# EAGLE design G009B (EAGLE 6.6.0)
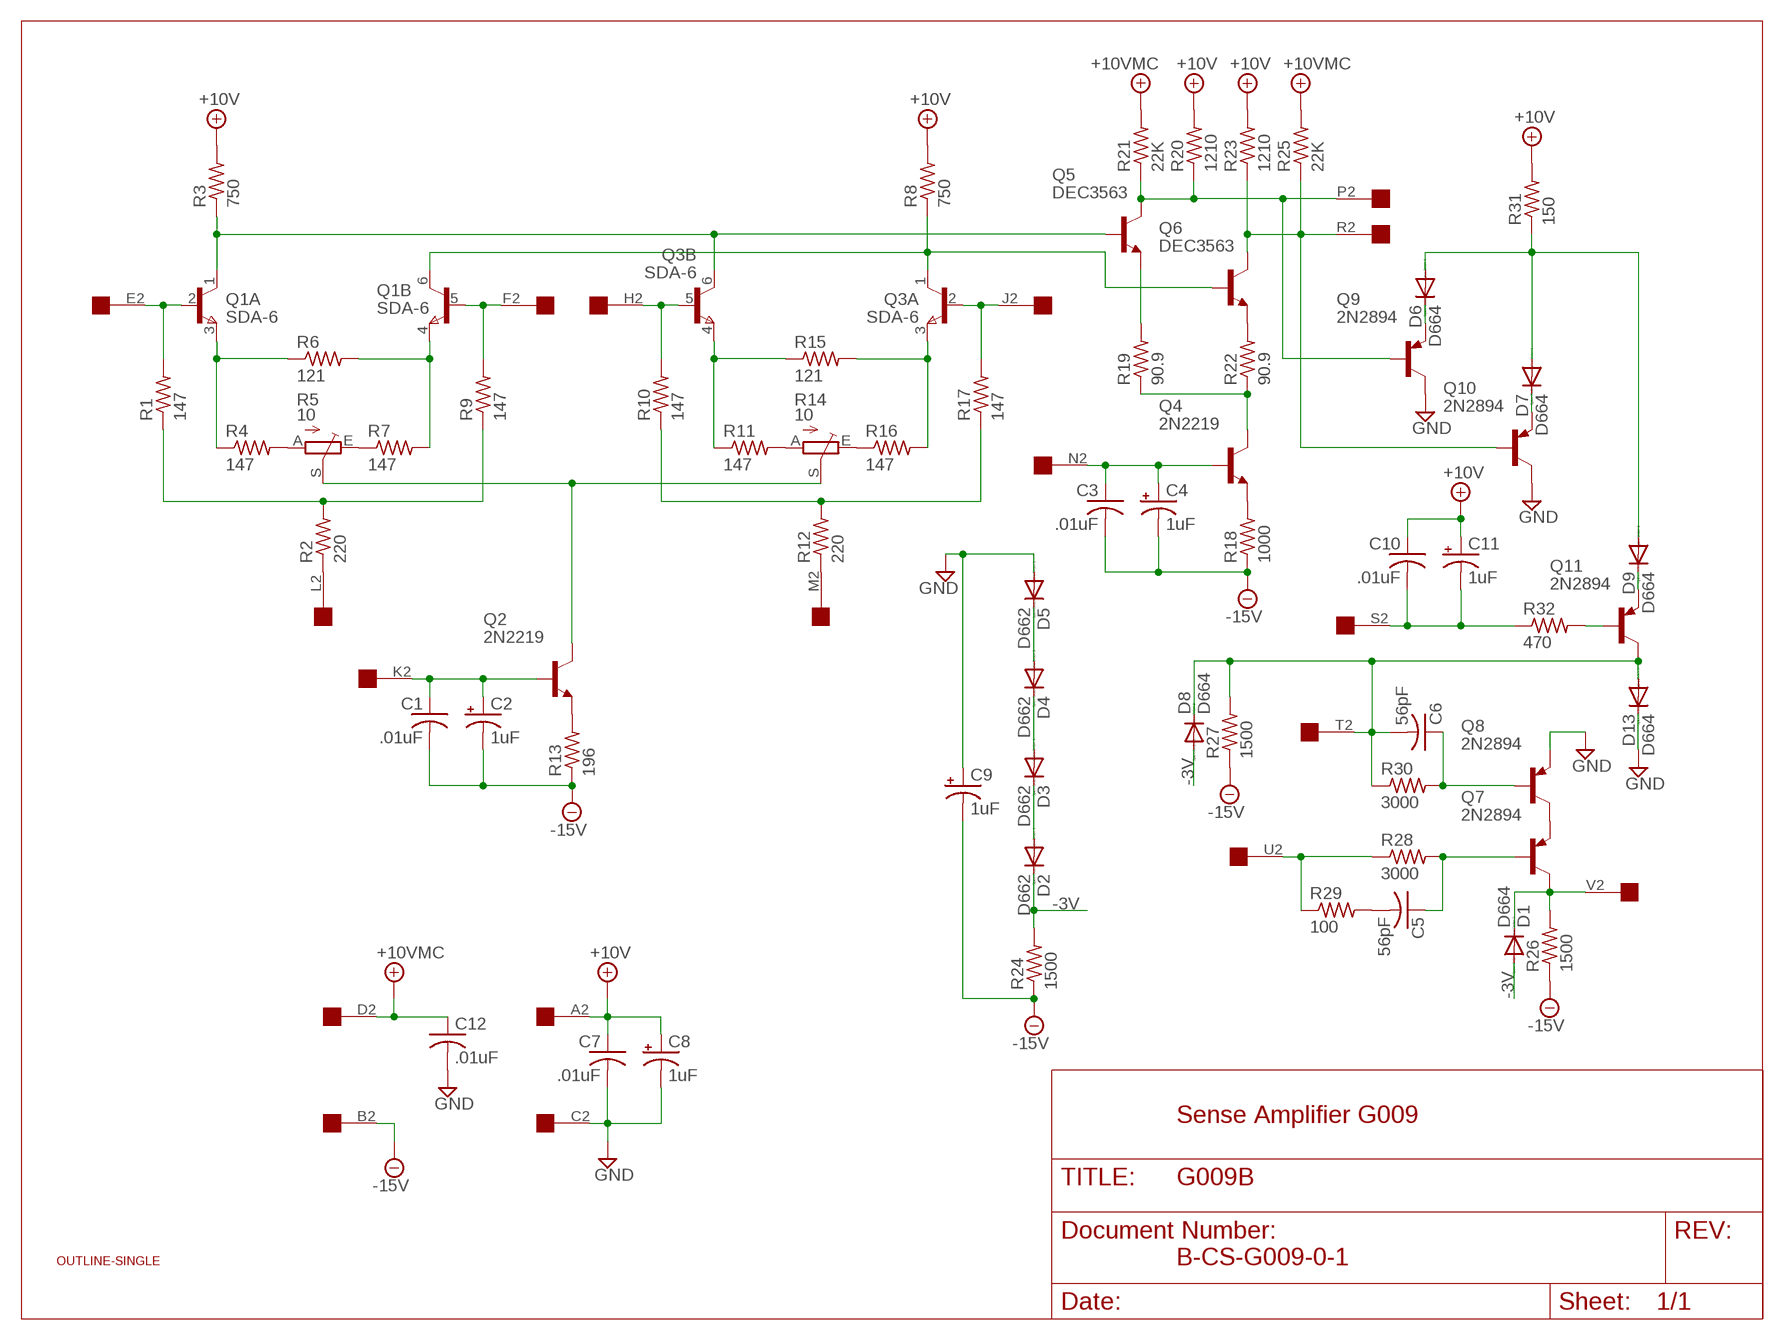
[diagram p0: schematic, sheet 1]

## Parts
C1  .01uF  C-US  [C063-025X075]
C2  1uF  CPOL-USE15-5AXIAL  [E15-5]
C3  .01uF  C-US  [C063-025X075]
C4  1uF  CPOL-USE15-5AXIAL  [E15-5]
C5  56pF  C-US150-054X183  [C150-054X183]
C6  56pF  C-US150-054X183  [C150-054X183]
C7  .01uF  C-US  [C063-025X075]
C8  1uF  CPOL-USE15-5AXIAL  [E15-5]
C9  1uF  CPOL-USE15-5AXIAL  [E15-5]
C10  .01uF  C-US  [C063-025X075]
C11  1uF  CPOL-USE15-5AXIAL  [E15-5]
C12  .01uF  C-US  [C063-025X075]
D1  D664  DIODE-DO35-10  [DO35-10]
D2  D662  DIODE-DO35-10  [DO35-10]
D3  D662  DIODE-DO35-10  [DO35-10]
D4  D662  DIODE-DO35-10  [DO35-10]
D5  D662  DIODE-DO35-10  [DO35-10]
D6  D664  DIODE-DO35-10  [DO35-10]
D7  D664  DIODE-DO35-10  [DO35-10]
D8  D664  DIODE-DO35-10  [DO35-10]
D9  D664  DIODE-DO35-10  [DO35-10]
D13  D664  DIODE-DO35-10  [DO35-10]
Q1  SDA-6  MAT-01H  [TO78]
Q2  2N2219  [TO5]
Q3  SDA-6  MAT-01H  [TO78]
Q4  2N2219  [TO5]
Q5  DEC3563  -NPN-TO5  [TO5]
Q6  DEC3563  -NPN-TO5  [TO5]
Q7  2N2894  -PNP-TO5  [TO5]
Q8  2N2894  -PNP-TO5  [TO5]
Q9  2N2894  -PNP-TO5  [TO5]
Q10  2N2894  -PNP-TO5  [TO5]
Q11  2N2894  -PNP-TO5  [TO5]
R1  147  R-US_0207/15  [0207/15]
R2  220  R-US_0207/10  [0207/10]
R3  750  R-US_0207/15  [0207/15]
R4  147  R-US_0207/15  [0207/15]
R5  10  TRIM_EU-CT6  [CT6]
R6  121  R-US_0207/15  [0207/15]
R7  147  R-US_0207/15  [0207/15]
R8  750  R-US_0207/15  [0207/15]
R9  147  R-US_0207/15  [0207/15]
R10  147  R-US_0207/15  [0207/15]
R11  147  R-US_0207/15  [0207/15]
R12  220  R-US_0207/10  [0207/10]
R13  196  R-US_0207/15  [0207/15]
R14  10  TRIM_EU-CT6  [CT6]
R15  121  R-US_0207/15  [0207/15]
R16  147  R-US_0207/15  [0207/15]
R17  147  R-US_0207/15  [0207/15]
R18  1000  R-US_0207/15  [0207/15]
R19  90.9  R-US_0207/15  [0207/15]
R20  1210  R-US_0207/15  [0207/15]
R21  22K  R-US_0207/10  [0207/10]
R22  90.9  R-US_0207/15  [0207/15]
R23  1210  R-US_0207/15  [0207/15]
R24  1500  R-US_0207/10  [0207/10]
R25  22K  R-US_0207/10  [0207/10]
R26  1500  R-US_0207/10  [0207/10]
R27  1500  R-US_0207/10  [0207/10]
R28  3000  R-US_0207/10  [0207/10]
R29  100  R-US_0207/10  [0207/10]
R30  3000  R-US_0207/10  [0207/10]
R31  150  R-US_0207/10  [0207/10]
R32  470  R-US_0207/10  [0207/10]
U$1  OUTLINE-SINGLE  [SINGLE]
U$2  EDGE-1  [EDGE-CON1]

## Nets
+10V: C7.1 C8.+ C10.1 C11.+ R3.2 R8.2 R20.2 R23.2 R31.2 U$2.A2
+10VMC: C12.1 R21.2 R25.2 U$2.D2
-3V: D1.A D2.C D8.A R24.2
-15V: C1.2 C2.- C3.2 C4.- C9.- R13.1 R18.1 R24.1 R26.1 R27.1 U$2.B2
GND: C7.2 C8.- C9.+ C12.2 D5.A D13.C Q8.1(E) Q9.3(C) Q10.3(C) U$2.C2
N$1: Q1.2(A:B) R1.2 U$2.E2
N$2: R2.1 U$2.L2
N$3: R1.1 R2.2 R9.1
N$4: Q1.5(B:B) R9.2 U$2.F2
N$5: Q1.1(A:C) Q3.6(B:C) Q5.2(B) R3.1
N$6: Q1.6(B:C) Q3.1(A:C) Q6.2(B) R8.1
N$7: Q1.3(A:E) R4.1 R6.1
N$8: Q1.4(B:E) R6.2 R7.2
N$9: R4.2 R5.A
N$10: R5.E R7.1
N$11: Q3.5(B:B) R10.2 U$2.H2
N$12: R10.1 R12.2 R17.1
N$13: Q3.2(A:B) R17.2 U$2.J2
N$14: Q2.1(E) R13.2
N$15: C1.1 C2.+ Q2.2(B) U$2.K2
N$16: Q3.4(B:E) R11.1 R15.1
N$17: Q3.3(A:E) R15.2 R16.2
N$18: R11.2 R14.A
N$19: R14.E R16.1
N$20: R12.1 U$2.M2
N$21: Q2.3(C) R5.S R14.S
N$22: Q5.3(C) Q9.2(B) R20.1 R21.1 U$2.P2
N$23: Q4.1(E) R18.2
N$24: Q6.1(E) R22.2
N$25: Q5.1(E) R19.2
N$26: Q4.3(C) R19.1 R22.1
N$27: Q6.3(C) Q10.2(B) R23.1 R25.1 U$2.R2
N$28: C3.1 C4.+ Q4.2(B) U$2.N2
N$29: Q7.1(E) Q8.3(C)
N$30: D2.A D3.C
N$31: D3.A D4.C
N$32: D4.A D5.C
N$34: C10.2 C11.- R32.1 U$2.S2
N$35: D6.C Q9.1(E)
N$36: D7.C Q10.1(E)
N$37: D6.A D7.A D9.A R31.1
N$38: D9.C Q11.1(E)
N$39: C6.2 D8.C D13.A Q11.3(C) R27.2 R30.1 U$2.T2
N$40: Q11.2(B) R32.2
N$42: C5.1 Q7.2(B) R28.2
N$43: C5.2 R29.2
N$44: R28.1 R29.1 U$2.U2
N$45: C6.1 Q8.2(B) R30.2
N$46: D1.C Q7.3(C) R26.2 U$2.V2

## Notes on the sheet
- Sense Amplifier G009
- B-CS-G009-0-1

## Library data of the parts
C1 C3 C7 C10 C12 = dec-con:C-US: Capacitors with funky DEC lead spacing.
C2 C4 C8 C9 C11 = dec-con:CPOL-USE15-5AXIAL: 0.6" version of an electrolytic
C5 C6 = rcl:C-US: CAPACITOR, American symbol
D1-D9 D13 = diode:DIODE-: DIODE
Q1 Q3 = linear:MAT-01H: Dual TRANSISTOR
Q2 Q4 = transistor:2N2219: NPN TRANSISTOR
Q5 Q6 = transistor:*-NPN-: NPN Transistror BF959 corrected 2008.03.06
Q7-Q11 = transistor:*-PNP-: PNP Transistror
R1-R4 R6-R13 R15-R32 = rcl:R-US_: RESISTOR, American symbol
R5 R14 = pot:TRIM_EU-: POTENTIOMETER
U$1 = dec-con:OUTLINE-*: Board outlines for DEC boards.
U$2 = dec-con:EDGE-1: Single-Sided DEC Edge Connector -- (side 2)

## Board
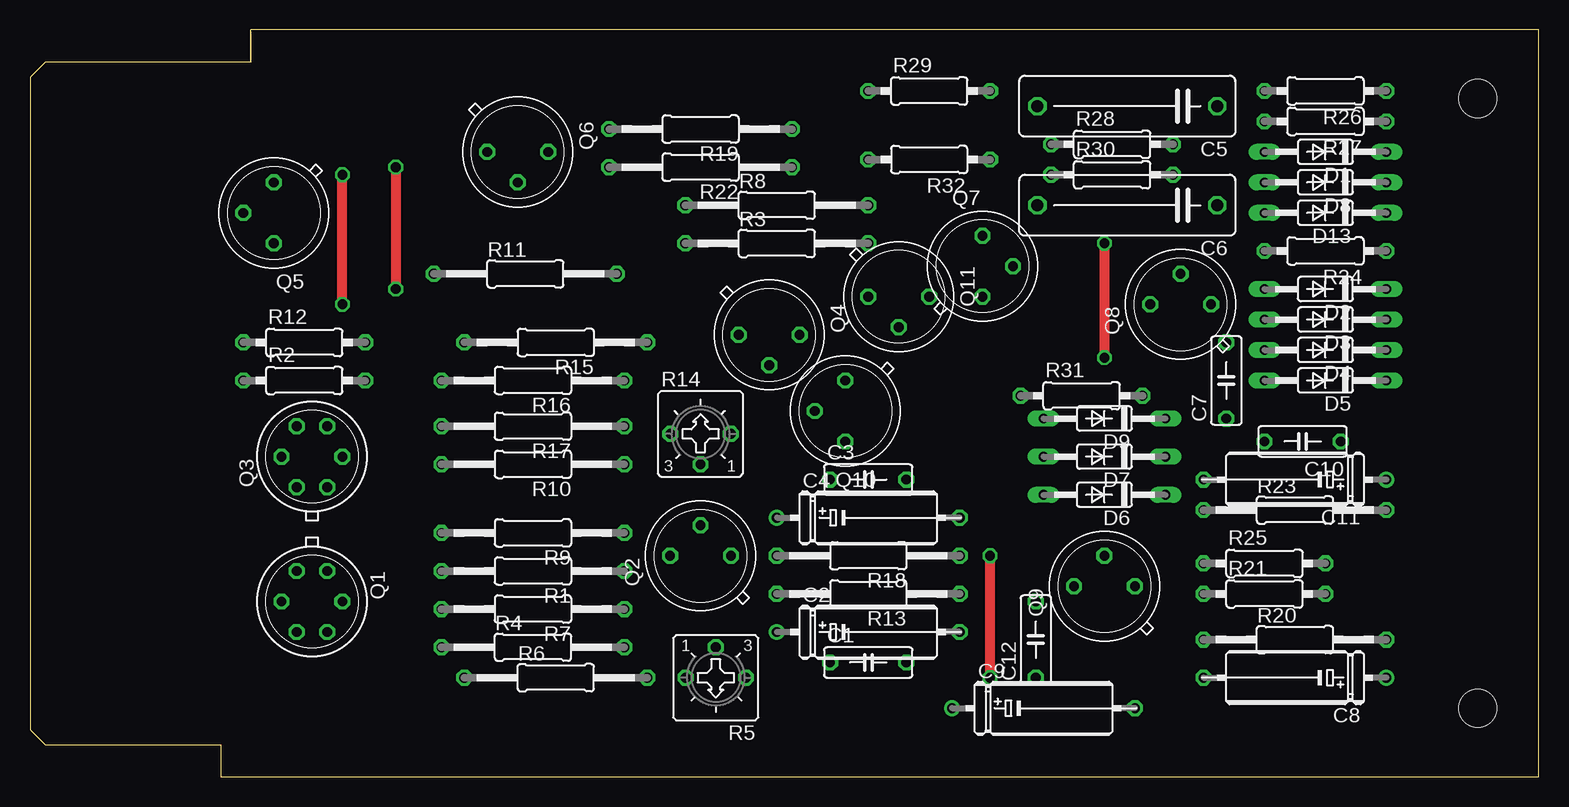
[diagram p1: board, top side]
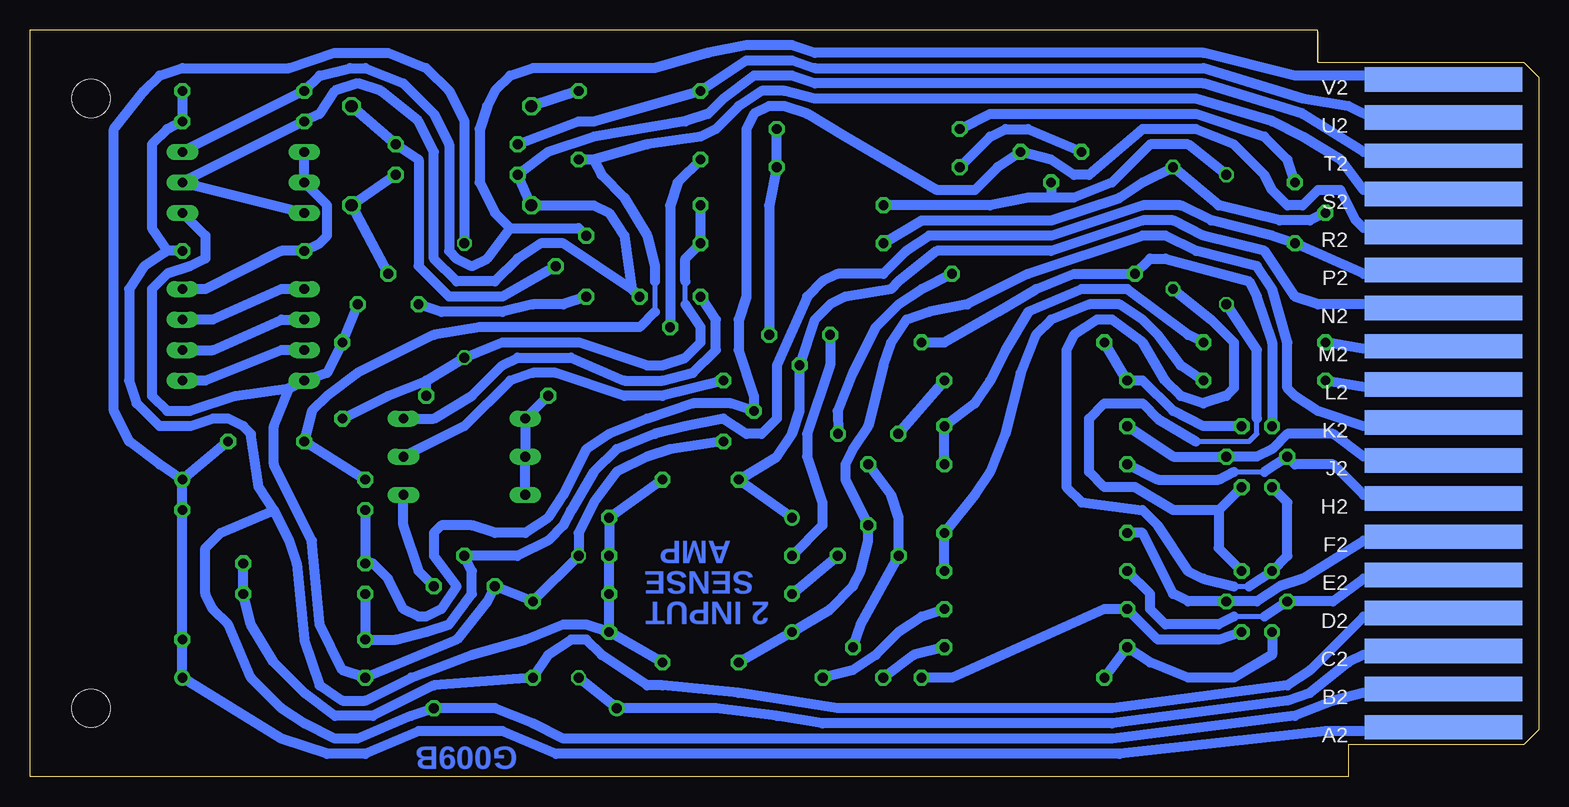
[diagram p2: board, bottom side, seen from below]

Size 125.73 x 62.23 mm. Coordinates in mm from the lower left corner, seen from the top.
Copper layers (1+16): Top 0.035mm / dielectric 1.5mm / Bottom 0.035mm
Design rules "16mils": minimum track width 16mil, minimum drill 32mil, track to track 15mil, track to pad 10mil, pad to pad 10mil, via to via 10mil, smd to smd 10mil, copper to edge 13mil, drill to drill 10mil, minimum pad ring 10mil, minimum via ring 8mil, stop-mask expansion 0mil, vias tented up to drill 0mil, thermal gap 10mil

### Footprints (pad centres in the part's own frame; a part is rotated, then mirrored left to right if it is on the bottom)
C063-025X075 = drill 0.813 octagon: 1 -2.54,0; 2 3.81,0
E15-5 = drill 0.813: + -7.62,0 | drill 0.813 octagon: - 7.62,0
C150-054X183 = drill 1.016 octagon: 1 -7.493,0; 2 7.493,0
DO35-10 = drill 0.813 long: A 5.08,0; C -5.08,0
TO78 = drill 0.813 octagon: 1 -2.54,-1.27; 2 0,-2.54; 3 2.54,-1.27; 4 2.54,1.27; 5 0,2.54; 6 -2.54,1.27
TO5 = drill 0.813 octagon: 1 0,-2.54; 2 2.54,0; 3 0,2.54
0207/15 = drill 0.813 octagon: 1 -7.62,0; 2 7.62,0
0207/10 = drill 0.813 octagon: 1 -5.08,0; 2 5.08,0
CT6 = drill 0.813 octagon: A 2.515,0; E -2.515,0; S 0,-2.54
SINGLE = hole 3.175: 120.65,56.515; 120.65,5.715
EDGE-CON1 = smd 13.106 x 2.032 bottom: A2 7.938,4.128; B2 7.938,7.303; C2 7.938,10.477; D2 7.938,13.652; E2 7.938,16.828; F2 7.938,20.003; H2 7.938,23.177; J2 7.938,26.352; K2 7.938,29.527; L2 7.938,32.703; M2 7.938,35.877; N2 7.938,39.053; P2 7.938,42.227; R2 7.938,45.403; S2 7.938,48.578; T2 7.938,51.752; U2 7.938,54.928; V2 7.938,58.102

### Placement (x,y rotation side)
C1  69.22,9.53 0 top
C2  69.85,12.06 0 top
C3  69.22,24.77 0 top
C4  69.85,21.59 0 top
C5  91.44,55.88 180 top
C6  91.44,47.62 180 top
C7  99.7,32.38 90 top
C8  105.41,8.26 180 top
C9  84.46,5.71 0 top
C10  106.68,27.94 180 top
C11  105.41,24.77 180 top
C12  83.82,10.79 90 top
D1  107.95,52.07 180 top
D2  107.95,40.64 180 top
D3  107.95,38.1 180 top
D4  107.95,35.56 180 top
D5  107.95,33.02 180 top
D6  89.54,23.5 180 top
D7  89.54,26.67 180 top
D8  107.95,49.53 180 top
D9  89.54,29.84 180 top
D13  107.95,46.99 180 top
Q1  23.5,14.61 270 top
Q2  55.88,18.41 90 top
Q3  23.5,26.67 90 top
Q4  61.6,36.83 270 top
Q5  20.32,46.99 180 top
Q6  40.64,52.07 270 top
Q7  79.38,42.55 0 top
Q8  95.89,39.37 90 top
Q9  89.54,15.88 90 top
Q10  67.95,30.48 180 top
Q11  72.39,40.01 270 top
R1  41.91,17.14 180 top
R2  22.86,33.02 0 top
R3  62.23,44.45 0 top
R4  41.91,10.79 0 top
R5  57.15,8.26 180 top
R6  43.82,8.26 0 top
R7  41.91,13.97 180 top
R8  62.23,47.62 0 top
R9  41.91,20.32 180 top
R10  41.91,26.04 180 top
R11  41.28,41.91 0 top
R12  22.86,36.2 0 top
R13  69.85,15.24 180 top
R14  55.88,28.57 0 top
R15  43.82,36.2 180 top
R16  41.91,33.02 180 top
R17  41.91,29.21 180 top
R18  69.85,18.41 180 top
R19  55.88,53.98 180 top
R20  105.41,11.43 0 top
R21  102.87,15.24 0 top
R22  55.88,50.8 180 top
R23  105.41,22.23 0 top
R24  107.95,43.81 180 top
R25  102.87,17.78 0 top
R26  107.95,57.15 180 top
R27  107.95,54.61 180 top
R28  90.17,52.7 0 top
R29  74.93,57.15 0 top
R30  90.17,50.16 0 top
R31  87.63,31.75 0 top
R32  74.93,51.44 180 top
U$1  0,0 0 top
U$2  0,0 0 top

### Tracks (layer width: path | path; a pad name or v marks a point on that pad's centre or on a via)
+10V  (via drill 0.81)
  Top 0.813: v89.54,44.45 v89.54,34.92
  Bottom 0.406: 71.12,39.37 71.12,41.27
  Bottom 0.813: R8.2 R3.2 71.12,43.18 71.12,41.27 | U$2.A2 8.89,3.81 17.78,3.81 34.93,1.91 81.92,1.91 86.36,3.81 93.35,3.81 97.79,1.91 100.97,1.91 104.78,3.17 C8.+ R20.2 R23.2 C11.+ | C11.+ 114.94,26.04 117.48,27.94 118.75,30.48 118.75,53.98 116.21,57.15 114.94,58.42 113.03,59.05 104.14,59.05 100.33,60.33 95.89,60.33 92.71,59.05 90.81,57.15 89.54,54.61 v89.54,44.45 | 71.12,39.37 69.85,37.47 69.85,36.2 71.12,34.92 73.03,34.29 74.3,34.29 80.01,36.2 86.36,36.2 v89.54,34.92 92.71,33.02 | C10.1 C11.+ | R31.2 92.71,33.02 | C7.1 95.89,31.75 92.71,33.02
+10VMC
  Bottom 0.813: R25.2 R21.2 107.32,12.7 105.41,9.53 102.87,6.99 100.33,5.08 97.16,5.08 92.08,7.62 C12.1 82.55,10.16 80.65,11.43 79.38,11.43 78.11,10.16 74.3,7.62 73.03,7.62 66.68,6.99 58.42,5.71 35.56,5.71 20.96,7.62 19.05,8.89 14.61,13.34 8.89,13.34 U$2.D2
-3V
  Bottom 0.813: D2.C 111.13,40.64 104.78,43.81 R24.2 101.6,44.45 100.97,45.09 100.97,47.62 D8.A D1.A
-15V
  Bottom 0.813: C1.2 C2.- | C2.- R13.1 R18.1 C4.- C3.2 | U$2.B2 8.26,6.99 14.61,6.99 17.15,6.35 20.32,5.08 35.56,3.17 81.28,3.17 83.82,4.45 87,5.71 C9.- 93.98,5.08 98.43,3.17 100.33,3.17 102.87,4.45 104.78,5.71 107.32,8.26 109.22,12.7 110.49,13.97 111.13,15.24 111.13,19.05 109.86,20.32 105.41,22.23 | 105.41,22.23 104.14,19.68 103.51,17.78 102.87,11.43 101.6,7.62 99.7,6.35 97.79,6.35 93.98,8.26 88.9,10.16 84.46,11.43 81.28,12.7 79.38,12.7 C2.- | 105.41,22.23 106.68,24.13 107.32,28.57 107.95,29.21 109.22,29.84 110.49,29.84 112.4,29.21 114.94,29.21 116.84,31.11 117.48,33.02 117.48,40.64 116.21,42.55 114.3,43.81 | R24.1 114.3,43.81 | R26.1 R27.1 114.3,53.98 115.57,52.7 115.57,45.72 114.3,43.81 | 114.3,43.81 114.45,43.72
GND  (via drill 0.81)
  Top 0.813: v80.01,8.26 v80.01,18.41
  Bottom 0.813: U$2.C2 8.26,10.16 14.61,10.16 15.88,9.53 19.05,6.99 20.96,6.35 35.56,4.45 59.69,4.45 63.5,5.08 68.58,5.71 C9.+ v80.01,8.26 | Q10.3 72.39,27.3 74.3,26.67 76.84,25.4 78.74,22.86 80.01,20.32 v80.01,18.41 C12.2 Q9.3 87.63,14.61 90.17,11.43 C8.- 99.7,8.89 101.6,12.7 102.24,19.68 105.41,26.04 105.41,29.21 104.14,32.38 | 104.14,32.38 D5.A 100.97,33.66 C7.2 Q8.1 | D13.C 111.13,45.09 111.13,43.18 112.4,42.55 114.3,41.91 115.57,40.64 115.57,31.75 114.3,30.48 112.4,30.48 108.59,31.75 104.14,32.38
N$1
  Bottom 0.406: 22.86,13.34 25.4,13.34
  Bottom 0.813: U$2.E2 8.26,16.51 14.61,16.51 17.15,14.61 Q1.2 22.86,13.34 | 25.4,13.34 26.67,12.7 31.12,12.7 32.39,13.97 32.39,15.24 R1.2
N$2
  Bottom 0.813: U$2.L2 9.53,32.38 13.97,32.38 R2.1
N$3
  Bottom 0.813: R1.1 R9.1 46.99,23.5 45.72,25.4 44.45,28.57 43.18,33.66 41.91,36.83 40.64,38.1 37.47,39.37 34.93,39.37 33.02,38.1 31.75,36.83 29.85,34.29 R2.2
N$4
  Bottom 0.813: U$2.F2 8.26,19.68 14.61,19.68 19.69,16.51 21.59,15.88 23.5,14.61 Q1.5 29.21,14.61 30.48,15.24 33.02,20.32 R9.2
N$5  (via drill 0.81)
  Top 0.813: v30.48,50.8 v30.48,40.64
  Bottom 0.406: 25.4,15.88 24.13,15.88
  Bottom 0.813: Q3.6 20.96,22.86 20.96,18.41 Q1.1 24.13,15.88 | R3.1 51.44,46.35 40.64,46.35 34.93,48.26 33.02,49.53 v30.48,50.8 26.67,47.62 21.59,46.35 19.05,46.35 Q5.2 | v30.48,40.64 27.31,38.1 25.4,36.2 25.4,32.38 26.04,31.75 27.94,31.11 29.85,31.75 31.12,33.02 33.02,36.2 35.56,38.1 36.83,38.1 38.74,36.83 39.37,35.56 39.37,24.13 38.1,22.86 33.02,22.23 31.75,20.95 29.21,17.14 27.94,16.51 25.4,15.88
N$6  (via drill 0.81)
  Top 0.813: v26.04,39.37 v26.04,50.16
  Bottom 0.406: 28.58,27.94 24.13,27.94 23.5,28.57 23.5,29.84
  Bottom 0.813: Q3.1 26.67,22.23 | 26.67,22.23 26.67,19.05 Q1.6 | 26.67,22.23 30.48,22.23 33.66,24.13 36.2,24.13 37.47,25.4 37.47,29.84 36.2,31.11 33.02,31.11 31.75,29.84 28.58,27.94 | 23.5,29.84 23.5,35.56 v26.04,39.37 | v26.04,50.16 29.21,52.7 32.39,52.7 35.56,49.53 38.74,48.26 40.64,48.26 | Q6.2 40.64,48.26 | 40.64,48.26 42.55,48.26 45.72,47.62 R8.1
N$7
  Bottom 0.813: Q1.3 22.23,10.16 25.4,8.26 29.21,8.26 32.39,9.53 R4.1 R6.1
N$8
  Bottom 0.813: R6.2 48.9,8.26 36.2,13.97 R7.2 31.75,11.43 26.67,11.43 Q1.4
N$9
  Bottom 0.813: R4.2 52.07,10.16 R5.A
N$10
  Bottom 0.813: R7.1 51.44,13.34 53.34,12.06 55.25,10.16 57.15,8.89 R5.E
N$11
  Bottom 0.406: 25.4,25.4 22.86,25.4
  Bottom 0.813: U$2.H2 8.89,23.5 14.61,23.5 17.15,26.04 20.32,26.04 Q3.5 22.86,25.4 | R10.2 31.75,24.77 26.67,24.77 25.4,25.4
N$12
  Bottom 0.813: R10.1 R17.1 46.99,31.11 45.72,33.02 44.45,35.56 42.55,38.73 38.1,40.64 34.29,40.64 29.21,36.83 R12.2
N$13
  Bottom 0.813: U$2.J2 8.89,26.67 14.61,26.67 17.15,28.57 20.96,28.57 22.23,27.3 23.5,26.67 Q3.2 30.48,26.67 R17.2
N$14
  Bottom 0.813: R13.2 Q2.1
N$15
  Bottom 0.813: U$2.K2 6.99,29.21 14.61,29.21 18.42,30.48 20.32,31.75 20.96,32.38 20.96,36.2 22.23,40.64 23.5,42.55 28.58,43.81 31.12,45.09 33.02,45.09 42.55,41.91 47.63,39.37 50.8,38.73 52.71,38.1 53.98,36.2 54.61,34.29 55.88,29.21 57.15,27.3 57.79,26.04 57.79,24.77 Q2.2 55.88,19.68 56.52,17.14 57.15,15.88 59.06,13.97 C2.+ C1.1
N$16
  Bottom 0.813: R15.1 49.53,36.2 45.09,38.73 41.91,40.64 38.74,41.91 R11.1 32.39,43.18 31.12,43.18 24.13,41.27 23.5,40.01 22.23,36.2 Q3.4
N$17
  Bottom 0.813: R15.2 R16.2 33.02,33.02 30.48,30.48 27.94,29.21 Q3.3
N$18
  Bottom 0.813: R11.2 51.44,40.64 53.34,39.37 55.25,37.47 57.15,33.66 58.42,30.48 R14.A
N$19
  Bottom 0.813: R16.1 R14.E
N$20
  Bottom 0.813: U$2.M2 8.26,35.56 13.97,35.56 R12.1
N$21
  Bottom 0.813: R14.S 53.98,23.5 53.34,21.59 Q2.3 56.52,12.7 R5.S
N$22
  Bottom 0.813: U$2.P2 8.89,41.91 14.61,41.91 Q5.3 22.23,45.09 27.31,46.35 29.85,47.62 33.02,47.62 40.64,45.09 50.8,45.09 52.71,43.81 54.61,41.91 58.42,41.91 59.69,41.27 60.96,40.01 63.5,34.29 63.5,29.84 64.77,28.57 66.04,28.57 67.95,29.84 71.12,29.21 73.66,28.57 76.84,27.3 78.74,25.4 80.65,22.23 81.28,20.95 82.55,19.68 85.09,18.41 Q9.2 88.9,17.14 88.9,15.24 90.81,12.7 92.71,12.06 95.25,11.43 R20.1 R21.1
N$23
  Bottom 0.813: Q4.1 59.06,34.29 60.96,28.57 60.96,26.67 59.69,22.86 59.69,20.95 R18.2
N$24
  Bottom 0.813: R22.2 45.72,53.34 44.45,53.98 42.55,53.98 Q6.1
N$25
  Bottom 0.813: R19.2 45.72,55.24 28.58,55.24 22.86,53.34 20.96,51.44 Q5.1
N$26
  Bottom 0.813: R19.1 R22.1 64.14,47.62 Q4.3
N$27
  Bottom 0.813: U$2.R2 8.89,45.72 14.61,45.72 15.24,46.35 16.51,48.9 18.42,48.9 19.69,47.62 20.96,47.62 22.23,48.9 22.86,50.16 25.4,52.7 28.58,53.98 33.02,53.98 37.47,50.16 38.74,50.16 40.64,51.44 Q6.3 45.09,50.8 46.99,48.9 50.17,48.9 57.79,53.34 60.96,55.24 62.87,55.88 64.14,55.88 65.41,55.24 66.04,53.98 66.04,40.01 66.68,38.1 66.68,35.56 65.41,31.75 Q10.2 67.31,31.11 70.49,31.11 74.3,29.84 77.47,28.57 79.38,27.3 81.28,23.5 82.55,21.59 84.46,20.32 87,20.32 88.9,20.95 91.44,20.95 92.08,20.32 92.08,18.41 90.17,15.88 91.44,13.97 92.71,13.34 93.35,13.34 94.62,13.97 95.89,16.51 97.16,17.78 R25.1 R23.1
N$28
  Bottom 0.813: U$2.N2 8.89,39.37 18.42,39.37 20.32,40.01 22.86,43.81 27.94,45.09 30.48,46.35 33.02,46.35 40.64,43.81 50.17,43.81 53.34,41.27 53.98,40.64 57.79,40.01 59.06,39.37 60.33,38.1 Q4.2 61.6,30.48 62.23,28.57 63.5,26.67 C3.1 C4.+
N$29
  Bottom 0.813: Q7.1 81.28,39.37 83.82,39.37 86.36,38.73 91.44,38.73 Q8.3
N$30
  Bottom 0.813: D2.A 104.78,40.64 110.49,38.1 D3.C
N$31
  Bottom 0.813: D4.C 110.49,35.56 104.78,38.1 D3.A
N$32
  Bottom 0.813: D4.A 104.78,35.56 111.13,33.02 D5.C
N$34
  Bottom 0.406: 73.66,41.27 73.66,38.73
  Bottom 0.813: U$2.S2 8.89,48.9 14.61,48.9 16.51,51.44 19.69,53.34 22.23,54.61 28.58,56.52 60.33,56.52 62.87,57.15 64.77,57.15 66.68,55.88 68.58,53.98 69.85,53.34 74.3,52.7 78.74,51.44 | 78.74,51.44 R32.1 | C11.- C10.2 102.24,30.48 100.97,31.75 98.43,33.66 92.08,36.83 88.27,37.47 74.93,37.47 73.66,38.73 | 78.74,51.44 78.11,50.16 76.2,48.26 74.3,45.09 73.66,42.55 73.66,41.27
N$35
  Bottom 0.813: Q9.1 93.35,17.14 94.62,20.95 D6.C
N$36
  Bottom 0.813: Q10.1 73.03,31.75 76.2,31.75 81.92,33.66 83.82,33.66 85.73,33.02 89.54,29.21 D7.C
N$37
  Bottom 0.813: D6.A D7.A D9.A R31.1
N$38
  Bottom 0.813: D9.C 92.08,29.84 88.9,31.75 86.36,34.29 85.09,34.92 80.65,34.92 76.2,33.02 73.03,33.02 70.49,33.66 68.58,35.56 68.58,38.1 Q11.1
N$39
  Bottom 0.813: 75.57,40.64 81.28,44.45 83.19,44.45 85.09,43.18 87,41.27 90.17,41.27 92.08,43.18 92.08,52.07 93.35,54.61 96.52,57.15 98.43,57.78 100.33,57.15 101.6,55.24 R27.2 D8.C D13.A | U$2.T2 8.89,52.07 14.61,52.07 19.69,55.24 27.94,57.78 60.33,57.78 62.23,58.42 65.41,58.42 67.95,56.52 69.22,55.24 71.12,54.61 78.74,53.34 82.55,52.07 R30.1 C6.2 78.74,47.62 77.47,46.99 76.2,45.09 75.57,40.64 | 75.57,40.64 Q11.3
N$40
  Bottom 0.813: R32.2 71.76,49.53 72.39,47.62 Q11.2
N$42
  Bottom 0.813: C5.1 R28.2 93.35,51.44 93.35,42.55 90.81,40.01 86.36,40.01 Q7.2
N$43
  Bottom 0.813: R29.2 C5.2
N$44
  Bottom 0.813: R28.1 80.01,54.61 78.74,54.61 R29.1 66.04,59.69 62.23,59.69 60.33,59.05 27.94,59.05 19.69,56.52 15.88,55.88 13.34,54.61 8.26,54.61 U$2.U2
N$45
  Bottom 0.813: R30.2 C6.1 Q8.2
N$46
  Bottom 0.813: U$2.V2 8.26,58.42 20.32,58.42 27.94,60.33 60.33,60.33 62.23,60.96 66.04,60.96 69.22,60.33 73.66,59.05 83.82,59.05 85.73,58.42 87,57.15 87.63,55.88 88.27,53.98 88.27,49.53 87,46.99 85.73,45.72 | 85.73,45.72 80.01,45.72 Q7.3 | D1.C R26.2 101.6,58.42 99.06,59.05 97.79,59.05 94.62,57.78 92.08,55.24 90.81,52.7 90.81,43.81 90.17,43.18 88.9,42.55 87.63,43.18 85.73,45.72

### Text on the board
Bottom: AMP | SENSE | 2 INPUT | G009B